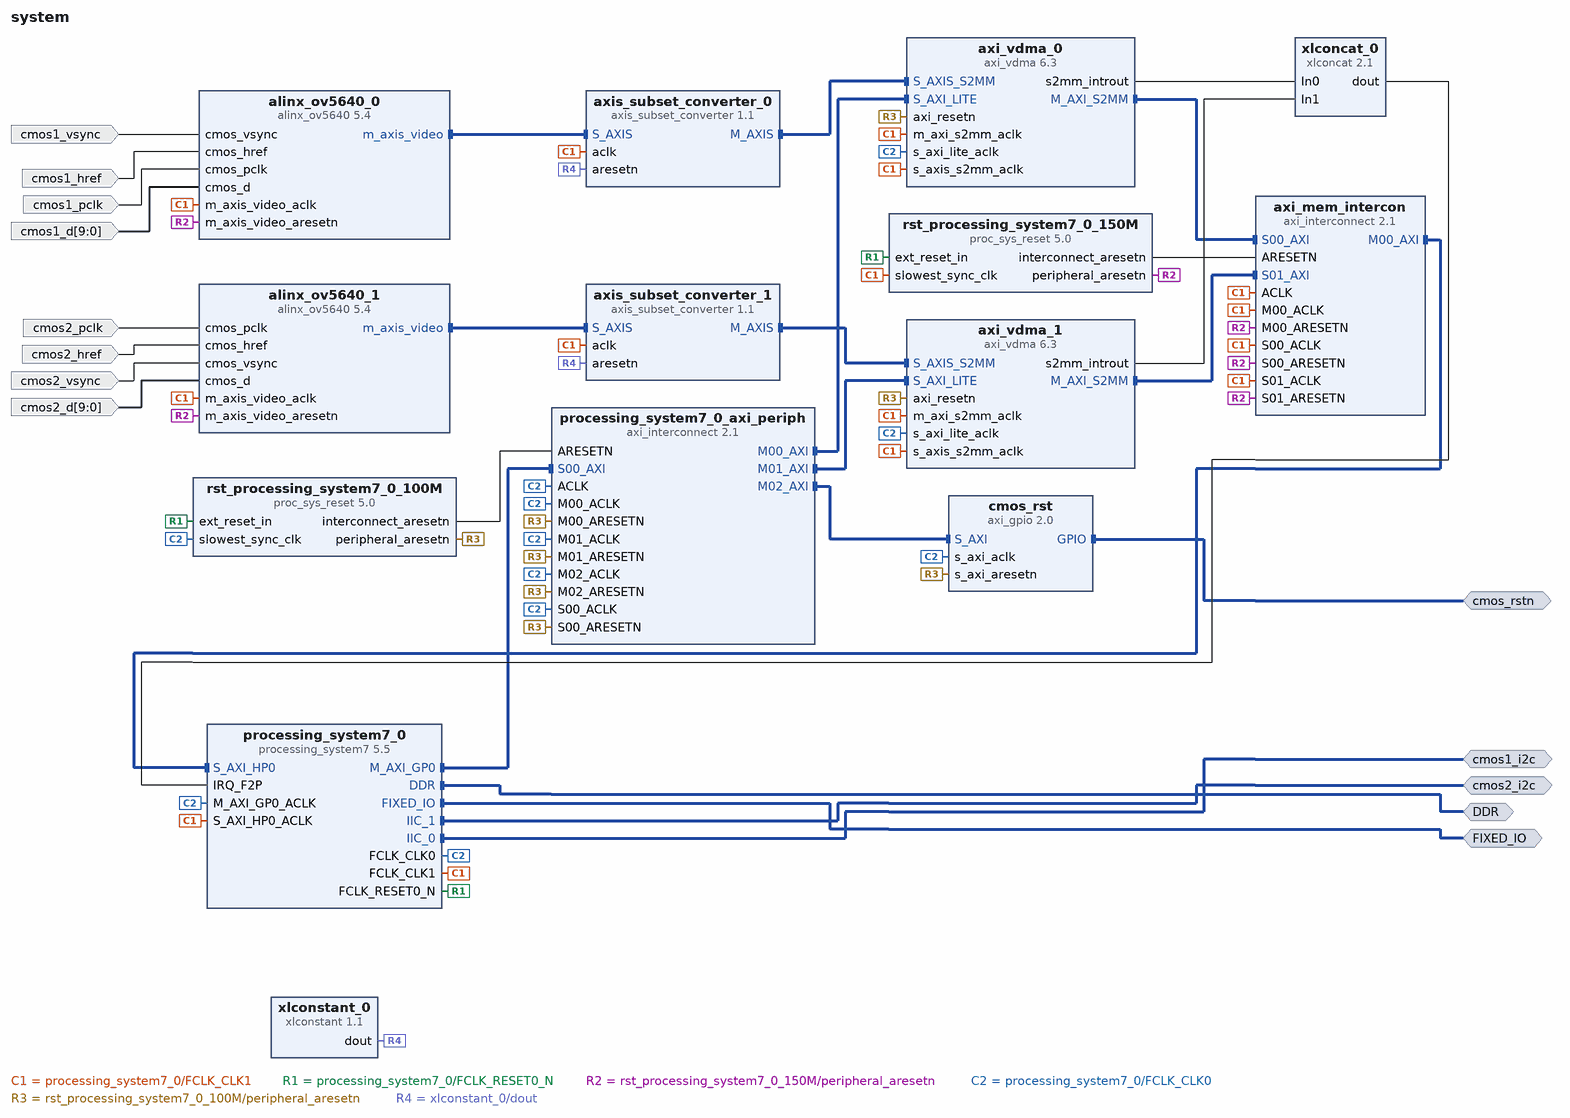
[diagram p0: block diagram of the top level]
# Vivado block design system, xc7z020clg400-2, Vivado 2017.4
create_bd_design system

create_bd_intf_port -mode Master -vlnv xilinx.com:interface:ddrx_rtl:1.0 DDR
create_bd_intf_port -mode Master -vlnv xilinx.com:display_processing_system7:fixedio_rtl:1.0 FIXED_IO
create_bd_intf_port -mode Master -vlnv xilinx.com:interface:iic_rtl:1.0 cmos2_i2c
create_bd_intf_port -mode Master -vlnv xilinx.com:interface:gpio_rtl:1.0 cmos_rstn
create_bd_intf_port -mode Master -vlnv xilinx.com:interface:iic_rtl:1.0 cmos1_i2c
create_bd_port -dir I cmos2_pclk
create_bd_port -dir I cmos2_href
create_bd_port -dir I cmos2_vsync
create_bd_port -dir I -from 9 -to 0 cmos2_d
create_bd_port -dir I cmos1_vsync
create_bd_port -dir I cmos1_href
create_bd_port -dir I cmos1_pclk
create_bd_port -dir I -from 9 -to 0 cmos1_d

create_bd_cell -type ip -vlnv www.alinx.com.cn:user:alinx_ov5640:5.4 alinx_ov5640_1
create_bd_cell -type ip -vlnv www.alinx.com.cn:user:alinx_ov5640:5.4 alinx_ov5640_0
create_bd_cell -type ip -vlnv xilinx.com:ip:axi_gpio:2.0 cmos_rst
set_property -dict {CONFIG.C_GPIO_WIDTH 2 CONFIG.C_ALL_OUTPUTS 1} [get_bd_cells cmos_rst]
create_bd_cell -type ip -vlnv xilinx.com:ip:axi_interconnect:2.1 axi_mem_intercon
set_property -dict {CONFIG.NUM_SI 2 CONFIG.NUM_MI 1 CONFIG.SYNCHRONIZATION_STAGES 2} [get_bd_cells axi_mem_intercon]
create_bd_cell -type ip -vlnv xilinx.com:ip:axi_vdma:6.3 axi_vdma_0
set_property -dict [list \
  CONFIG.c_m_axi_s2mm_data_width 64 \
  CONFIG.c_include_s2mm_dre 1 \
  CONFIG.c_num_fstores 3 \
  CONFIG.c_use_s2mm_fsync 2 \
  CONFIG.c_s2mm_genlock_mode 0 \
  CONFIG.c_s2mm_linebuffer_depth 4096 \
  CONFIG.c_include_mm2s 0 \
  CONFIG.c_s2mm_max_burst_length 128 \
  CONFIG.c_enable_vert_flip 0 \
] [get_bd_cells axi_vdma_0]
create_bd_cell -type ip -vlnv xilinx.com:ip:axi_vdma:6.3 axi_vdma_1
set_property -dict [list \
  CONFIG.c_m_axi_s2mm_data_width 64 \
  CONFIG.c_include_s2mm_dre 1 \
  CONFIG.c_num_fstores 3 \
  CONFIG.c_use_s2mm_fsync 2 \
  CONFIG.c_s2mm_genlock_mode 0 \
  CONFIG.c_s2mm_linebuffer_depth 4096 \
  CONFIG.c_include_mm2s 0 \
  CONFIG.c_s2mm_max_burst_length 128 \
  CONFIG.c_enable_vert_flip 0 \
] [get_bd_cells axi_vdma_1]
create_bd_cell -type ip -vlnv xilinx.com:ip:axis_subset_converter:1.1 axis_subset_converter_0
set_property -dict [list \
  CONFIG.S_TDATA_NUM_BYTES 2 \
  CONFIG.M_TDATA_NUM_BYTES 3 \
  CONFIG.S_TUSER_WIDTH 1 \
  CONFIG.M_TUSER_WIDTH 1 \
  CONFIG.S_HAS_TLAST 1 \
  CONFIG.M_HAS_TLAST 1 \
  CONFIG.TDATA_REMAP {tdata[4:0],3'b000,tdata[10:5],2'b00,tdata[15:11],3'b000} \
  CONFIG.TUSER_REMAP {tuser[0:0]} \
  CONFIG.TKEEP_REMAP {1'b1,tkeep[1:0]} \
  CONFIG.TLAST_REMAP {tlast[0]} \
] [get_bd_cells axis_subset_converter_0]
create_bd_cell -type ip -vlnv xilinx.com:ip:axis_subset_converter:1.1 axis_subset_converter_1
set_property -dict [list \
  CONFIG.S_TDATA_NUM_BYTES 2 \
  CONFIG.M_TDATA_NUM_BYTES 3 \
  CONFIG.S_TUSER_WIDTH 1 \
  CONFIG.M_TUSER_WIDTH 1 \
  CONFIG.S_HAS_TLAST 1 \
  CONFIG.M_HAS_TLAST 1 \
  CONFIG.TDATA_REMAP {tdata[4:0],3'b000,tdata[10:5],2'b00,tdata[15:11],3'b000} \
  CONFIG.TUSER_REMAP {tuser[0:0]} \
  CONFIG.TKEEP_REMAP {1'b1,tkeep[1:0]} \
  CONFIG.TLAST_REMAP {tlast[0]} \
] [get_bd_cells axis_subset_converter_1]
create_bd_cell -type ip -vlnv xilinx.com:ip:processing_system7:5.5 processing_system7_0
set_property -dict [list \
  CONFIG.PCW_FCLK_CLK1_BUF TRUE \
  CONFIG.PCW_FCLK_CLK2_BUF TRUE \
  CONFIG.PCW_UIPARAM_DDR_FREQ_MHZ 533.333333 \
  CONFIG.PCW_CPU_CPU_6X4X_MAX_RANGE 767 \
  CONFIG.PCW_APU_PERIPHERAL_FREQMHZ 767 \
  CONFIG.PCW_SDIO_PERIPHERAL_FREQMHZ 100 \
  CONFIG.PCW_UART_PERIPHERAL_FREQMHZ 100 \
  CONFIG.PCW_I2C_PERIPHERAL_FREQMHZ 127.777779 \
  CONFIG.PCW_FPGA0_PERIPHERAL_FREQMHZ 100 \
  CONFIG.PCW_FPGA1_PERIPHERAL_FREQMHZ 150 \
  CONFIG.PCW_FPGA2_PERIPHERAL_FREQMHZ 24 \
  CONFIG.PCW_USE_S_AXI_HP0 1 \
  CONFIG.PCW_USE_FABRIC_INTERRUPT 1 \
  CONFIG.PCW_EN_CLK1_PORT 1 \
  CONFIG.PCW_EN_CLK2_PORT 1 \
  CONFIG.PCW_IRQ_F2P_INTR 1 \
  CONFIG.PCW_GP0_EN_MODIFIABLE_TXN 0 \
  CONFIG.PCW_GP1_EN_MODIFIABLE_TXN 0 \
  CONFIG.PCW_PERIPHERAL_BOARD_PRESET None \
  CONFIG.PCW_PRESET_BANK1_VOLTAGE {LVCMOS 1.8V} \
  CONFIG.PCW_UIPARAM_DDR_PARTNO {MT41J256M16 RE-125} \
  CONFIG.PCW_QSPI_PERIPHERAL_ENABLE 1 \
  CONFIG.PCW_QSPI_QSPI_IO {MIO 1 .. 6} \
  CONFIG.PCW_QSPI_GRP_SINGLE_SS_ENABLE 1 \
  CONFIG.PCW_QSPI_GRP_SINGLE_SS_IO {MIO 1 .. 6} \
  CONFIG.PCW_SINGLE_QSPI_DATA_MODE x4 \
  CONFIG.PCW_ENET0_PERIPHERAL_ENABLE 1 \
  CONFIG.PCW_ENET0_ENET0_IO {MIO 16 .. 27} \
  CONFIG.PCW_ENET0_GRP_MDIO_ENABLE 1 \
  CONFIG.PCW_ENET0_GRP_MDIO_IO {MIO 52 .. 53} \
  CONFIG.PCW_ENET_RESET_ENABLE 1 \
  CONFIG.PCW_ENET_RESET_SELECT {Share reset pin} \
  CONFIG.PCW_ENET0_RESET_ENABLE 0 \
  CONFIG.PCW_SD0_PERIPHERAL_ENABLE 1 \
  CONFIG.PCW_SD0_SD0_IO {MIO 40 .. 45} \
  CONFIG.PCW_SD0_GRP_CD_ENABLE 1 \
  CONFIG.PCW_SD0_GRP_CD_IO {MIO 47} \
  CONFIG.PCW_SD0_GRP_WP_ENABLE 0 \
  CONFIG.PCW_UART1_PERIPHERAL_ENABLE 1 \
  CONFIG.PCW_UART1_UART1_IO {MIO 48 .. 49} \
  CONFIG.PCW_USB0_PERIPHERAL_ENABLE 1 \
  CONFIG.PCW_USB0_USB0_IO {MIO 28 .. 39} \
  CONFIG.PCW_USB_RESET_ENABLE 1 \
  CONFIG.PCW_USB_RESET_SELECT {Share reset pin} \
  CONFIG.PCW_USB0_RESET_ENABLE 1 \
  CONFIG.PCW_USB0_RESET_IO {MIO 46} \
  CONFIG.PCW_I2C0_PERIPHERAL_ENABLE 1 \
  CONFIG.PCW_I2C0_I2C0_IO EMIO \
  CONFIG.PCW_I2C1_PERIPHERAL_ENABLE 1 \
  CONFIG.PCW_I2C1_I2C1_IO EMIO \
  CONFIG.PCW_I2C_RESET_ENABLE 1 \
  CONFIG.PCW_I2C_RESET_SELECT {Share reset pin} \
  CONFIG.PCW_GPIO_MIO_GPIO_ENABLE 1 \
  CONFIG.PCW_GPIO_MIO_GPIO_IO MIO \
  CONFIG.PCW_FPGA_FCLK1_ENABLE 1 \
  CONFIG.PCW_FPGA_FCLK2_ENABLE 1 \
] [get_bd_cells processing_system7_0]
# 513 more settings of processing_system7_0 are not shown: defaults, MIO pin electricals, DDR timing, and values the tool derives
create_bd_cell -type ip -vlnv xilinx.com:ip:axi_interconnect:2.1 processing_system7_0_axi_periph
set_property -dict {CONFIG.NUM_MI 3 CONFIG.SYNCHRONIZATION_STAGES 2} [get_bd_cells processing_system7_0_axi_periph]
create_bd_cell -type ip -vlnv xilinx.com:ip:proc_sys_reset:5.0 rst_processing_system7_0_100M
create_bd_cell -type ip -vlnv xilinx.com:ip:proc_sys_reset:5.0 rst_processing_system7_0_150M
create_bd_cell -type ip -vlnv xilinx.com:ip:xlconcat:2.1 xlconcat_0
set_property -dict {CONFIG.NUM_PORTS 2 CONFIG.dout_width 2} [get_bd_cells xlconcat_0]
create_bd_cell -type ip -vlnv xilinx.com:ip:xlconstant:1.1 xlconstant_0

# ---- connections ----

connect_bd_intf_net [get_bd_intf_pins axi_mem_intercon/M00_AXI] [get_bd_intf_pins processing_system7_0/S_AXI_HP0]
connect_bd_intf_net [get_bd_intf_pins processing_system7_0/M_AXI_GP0] [get_bd_intf_pins processing_system7_0_axi_periph/S00_AXI]
connect_bd_intf_net -intf_net alinx_ov5640_RGB565_0_m_axis_video [get_bd_intf_pins alinx_ov5640_0/m_axis_video] [get_bd_intf_pins axis_subset_converter_0/S_AXIS]
connect_bd_intf_net [get_bd_intf_pins axis_subset_converter_0/M_AXIS] [get_bd_intf_pins axi_vdma_0/S_AXIS_S2MM]
connect_bd_intf_net -intf_net alinx_ov5640_RGB565_1_m_axis_video [get_bd_intf_pins alinx_ov5640_1/m_axis_video] [get_bd_intf_pins axis_subset_converter_1/S_AXIS]
connect_bd_intf_net [get_bd_intf_pins axis_subset_converter_1/M_AXIS] [get_bd_intf_pins axi_vdma_1/S_AXIS_S2MM]
connect_bd_intf_net -intf_net axi_vdma_1_M_AXI_S2MM [get_bd_intf_pins axi_vdma_0/M_AXI_S2MM] [get_bd_intf_pins axi_mem_intercon/S00_AXI]
connect_bd_intf_net -intf_net axi_vdma_3_M_AXI_S2MM [get_bd_intf_pins axi_vdma_1/M_AXI_S2MM] [get_bd_intf_pins axi_mem_intercon/S01_AXI]
connect_bd_intf_net [get_bd_intf_pins processing_system7_0_axi_periph/M00_AXI] [get_bd_intf_pins axi_vdma_0/S_AXI_LITE]
connect_bd_intf_net [get_bd_intf_pins processing_system7_0_axi_periph/M01_AXI] [get_bd_intf_pins axi_vdma_1/S_AXI_LITE]
connect_bd_intf_net [get_bd_intf_pins cmos_rst/S_AXI] [get_bd_intf_pins processing_system7_0_axi_periph/M02_AXI]
connect_bd_intf_net [get_bd_intf_ports DDR] [get_bd_intf_pins processing_system7_0/DDR]
connect_bd_intf_net [get_bd_intf_ports FIXED_IO] [get_bd_intf_pins processing_system7_0/FIXED_IO]
connect_bd_intf_net [get_bd_intf_ports cmos2_i2c] [get_bd_intf_pins processing_system7_0/IIC_1]
connect_bd_intf_net -intf_net axi_gpio_0_GPIO [get_bd_intf_ports cmos_rstn] [get_bd_intf_pins cmos_rst/GPIO]
connect_bd_intf_net [get_bd_intf_ports cmos1_i2c] [get_bd_intf_pins processing_system7_0/IIC_0]
connect_bd_net [get_bd_pins processing_system7_0/FCLK_CLK1] \
  [get_bd_pins alinx_ov5640_1/m_axis_video_aclk] [get_bd_pins alinx_ov5640_0/m_axis_video_aclk] \
  [get_bd_pins axi_vdma_0/m_axi_s2mm_aclk] [get_bd_pins axi_vdma_0/s_axis_s2mm_aclk] [get_bd_pins axi_vdma_1/m_axi_s2mm_aclk] \
  [get_bd_pins axi_vdma_1/s_axis_s2mm_aclk] [get_bd_pins axis_subset_converter_0/aclk] \
  [get_bd_pins axis_subset_converter_1/aclk] [get_bd_pins processing_system7_0/S_AXI_HP0_ACLK] \
  [get_bd_pins rst_processing_system7_0_150M/slowest_sync_clk] [get_bd_pins axi_mem_intercon/ACLK] \
  [get_bd_pins axi_mem_intercon/S00_ACLK] [get_bd_pins axi_mem_intercon/S01_ACLK] [get_bd_pins axi_mem_intercon/M00_ACLK]
connect_bd_net [get_bd_pins processing_system7_0/FCLK_RESET0_N] \
  [get_bd_pins rst_processing_system7_0_100M/ext_reset_in] [get_bd_pins rst_processing_system7_0_150M/ext_reset_in]
connect_bd_net -net rst_processing_system7_0_140M_peripheral_aresetn [get_bd_pins rst_processing_system7_0_150M/peripheral_aresetn] \
  [get_bd_pins alinx_ov5640_1/m_axis_video_aresetn] [get_bd_pins alinx_ov5640_0/m_axis_video_aresetn] \
  [get_bd_pins axi_mem_intercon/S00_ARESETN] [get_bd_pins axi_mem_intercon/S01_ARESETN] \
  [get_bd_pins axi_mem_intercon/M00_ARESETN]
connect_bd_net -net rst_processing_system7_0_140M_interconnect_aresetn [get_bd_pins rst_processing_system7_0_150M/interconnect_aresetn] \
  [get_bd_pins axi_mem_intercon/ARESETN]
connect_bd_net [get_bd_pins processing_system7_0/FCLK_CLK0] \
  [get_bd_pins cmos_rst/s_axi_aclk] [get_bd_pins axi_vdma_0/s_axi_lite_aclk] [get_bd_pins axi_vdma_1/s_axi_lite_aclk] \
  [get_bd_pins processing_system7_0/M_AXI_GP0_ACLK] [get_bd_pins rst_processing_system7_0_100M/slowest_sync_clk] \
  [get_bd_pins processing_system7_0_axi_periph/ACLK] [get_bd_pins processing_system7_0_axi_periph/S00_ACLK] \
  [get_bd_pins processing_system7_0_axi_periph/M00_ACLK] [get_bd_pins processing_system7_0_axi_periph/M01_ACLK] \
  [get_bd_pins processing_system7_0_axi_periph/M02_ACLK]
connect_bd_net [get_bd_pins rst_processing_system7_0_100M/peripheral_aresetn] \
  [get_bd_pins cmos_rst/s_axi_aresetn] [get_bd_pins axi_vdma_0/axi_resetn] [get_bd_pins axi_vdma_1/axi_resetn] \
  [get_bd_pins processing_system7_0_axi_periph/S00_ARESETN] [get_bd_pins processing_system7_0_axi_periph/M00_ARESETN] \
  [get_bd_pins processing_system7_0_axi_periph/M01_ARESETN] [get_bd_pins processing_system7_0_axi_periph/M02_ARESETN]
connect_bd_net [get_bd_pins rst_processing_system7_0_100M/interconnect_aresetn] [get_bd_pins processing_system7_0_axi_periph/ARESETN]
connect_bd_net [get_bd_pins xlconcat_0/dout] [get_bd_pins processing_system7_0/IRQ_F2P]
connect_bd_net -net xlconstant_1_dout [get_bd_pins xlconstant_0/dout] \
  [get_bd_pins axis_subset_converter_0/aresetn] [get_bd_pins axis_subset_converter_1/aresetn]
connect_bd_net -net cmos_pclk_1 [get_bd_ports cmos2_pclk] [get_bd_pins alinx_ov5640_1/cmos_pclk]
connect_bd_net -net cmos_href_1 [get_bd_ports cmos2_href] [get_bd_pins alinx_ov5640_1/cmos_href]
connect_bd_net -net cmos_vsync_1 [get_bd_ports cmos2_vsync] [get_bd_pins alinx_ov5640_1/cmos_vsync]
connect_bd_net -net cmos_d_1 [get_bd_ports cmos2_d] [get_bd_pins alinx_ov5640_1/cmos_d]
connect_bd_net [get_bd_ports cmos1_vsync] [get_bd_pins alinx_ov5640_0/cmos_vsync]
connect_bd_net [get_bd_ports cmos1_href] [get_bd_pins alinx_ov5640_0/cmos_href]
connect_bd_net -net cmos_pclk_2 [get_bd_ports cmos1_pclk] [get_bd_pins alinx_ov5640_0/cmos_pclk]
connect_bd_net -net cmos_d_2 [get_bd_ports cmos1_d] [get_bd_pins alinx_ov5640_0/cmos_d]
connect_bd_net -net axi_vdma_3_s2mm_introut [get_bd_pins axi_vdma_1/s2mm_introut] [get_bd_pins xlconcat_0/In1]
connect_bd_net -net axi_vdma_1_s2mm_introut [get_bd_pins axi_vdma_0/s2mm_introut] [get_bd_pins xlconcat_0/In0]

# ---- address map ----
assign_bd_address -offset 0x00000000 -range 1G -target_address_space [get_bd_addr_spaces axi_vdma_0/Data_S2MM] [get_bd_addr_segs processing_system7_0/S_AXI_HP0/HP0_DDR_LOWOCM]
assign_bd_address -offset 0x00000000 -range 1G -target_address_space [get_bd_addr_spaces axi_vdma_1/Data_S2MM] [get_bd_addr_segs processing_system7_0/S_AXI_HP0/HP0_DDR_LOWOCM]
assign_bd_address -offset 0x41210000 -range 64K -target_address_space [get_bd_addr_spaces processing_system7_0/Data] [get_bd_addr_segs cmos_rst/S_AXI/Reg]
assign_bd_address -offset 0x43010000 -range 64K -target_address_space [get_bd_addr_spaces processing_system7_0/Data] [get_bd_addr_segs axi_vdma_0/S_AXI_LITE/Reg]
assign_bd_address -offset 0x43030000 -range 64K -target_address_space [get_bd_addr_spaces processing_system7_0/Data] [get_bd_addr_segs axi_vdma_1/S_AXI_LITE/Reg]

validate_bd_design
save_bd_design
